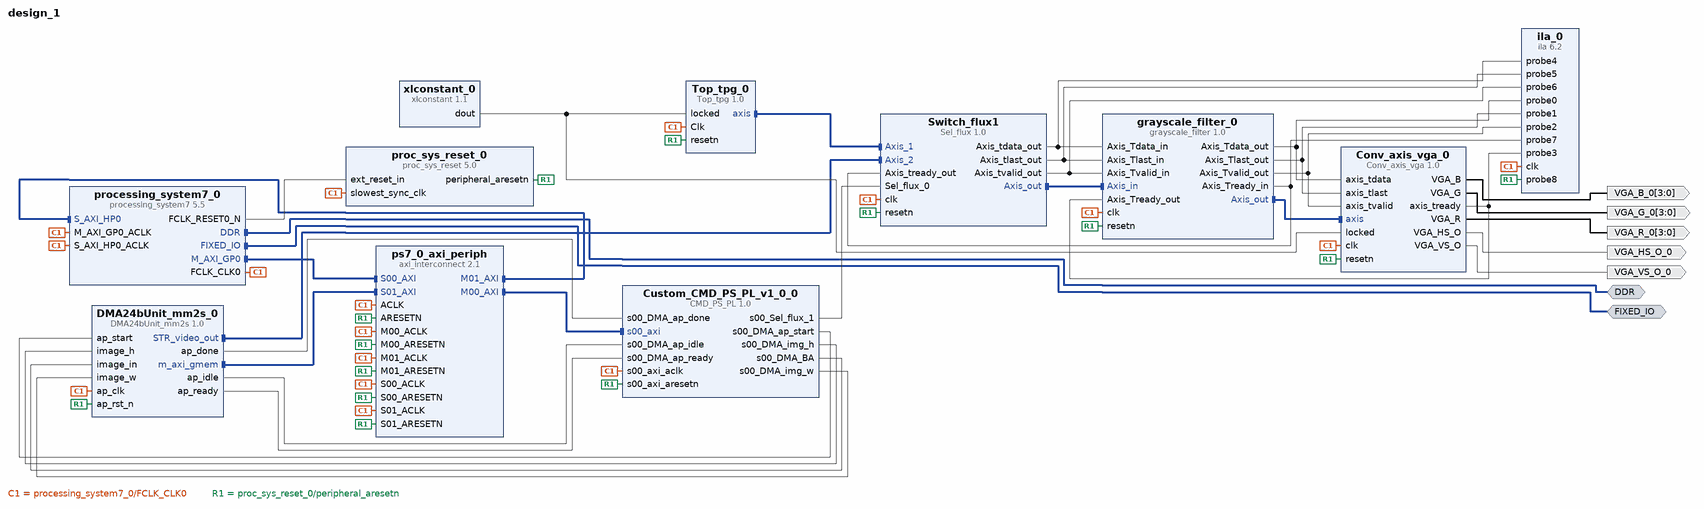
[diagram p0: block diagram of the top level]
# Vivado block design design_1, xc7z010clg400-1, Vivado 2020.2
create_bd_design design_1

create_bd_intf_port -mode Master -vlnv xilinx.com:interface:ddrx_rtl:1.0 DDR
create_bd_intf_port -mode Master -vlnv xilinx.com:display_processing_system7:fixedio_rtl:1.0 FIXED_IO
create_bd_port -dir O -from 3 -to 0 VGA_R_0
create_bd_port -dir O -from 3 -to 0 VGA_G_0
create_bd_port -dir O -from 3 -to 0 VGA_B_0
create_bd_port -dir O VGA_VS_O_0
create_bd_port -dir O VGA_HS_O_0

create_bd_cell -type ip -vlnv xilinx.com:ip:processing_system7:5.5 processing_system7_0
set_property -dict [list \
  CONFIG.PCW_APU_PERIPHERAL_FREQMHZ 650 \
  CONFIG.PCW_CRYSTAL_PERIPHERAL_FREQMHZ 50 \
  CONFIG.PCW_ENET0_PERIPHERAL_ENABLE 0 \
  CONFIG.PCW_FPGA0_PERIPHERAL_FREQMHZ 25 \
  CONFIG.PCW_FTM_CTI_IN0 DISABLED \
  CONFIG.PCW_FTM_CTI_IN1 DISABLED \
  CONFIG.PCW_FTM_CTI_IN2 DISABLED \
  CONFIG.PCW_FTM_CTI_IN3 DISABLED \
  CONFIG.PCW_FTM_CTI_OUT0 DISABLED \
  CONFIG.PCW_FTM_CTI_OUT1 DISABLED \
  CONFIG.PCW_FTM_CTI_OUT2 DISABLED \
  CONFIG.PCW_FTM_CTI_OUT3 DISABLED \
  CONFIG.PCW_GPIO_MIO_GPIO_ENABLE 1 \
  CONFIG.PCW_GPIO_MIO_GPIO_IO MIO \
  CONFIG.PCW_I2C_RESET_ENABLE 1 \
  CONFIG.PCW_PRESET_BANK1_VOLTAGE {LVCMOS 1.8V} \
  CONFIG.PCW_QSPI_PERIPHERAL_ENABLE 0 \
  CONFIG.PCW_SD0_GRP_CD_ENABLE 1 \
  CONFIG.PCW_SD0_GRP_CD_IO {MIO 47} \
  CONFIG.PCW_SD0_GRP_WP_ENABLE 0 \
  CONFIG.PCW_SD0_PERIPHERAL_ENABLE 1 \
  CONFIG.PCW_SD0_SD0_IO {MIO 40 .. 45} \
  CONFIG.PCW_SDIO_PERIPHERAL_FREQMHZ 100 \
  CONFIG.PCW_UART0_PERIPHERAL_ENABLE 1 \
  CONFIG.PCW_UART0_UART0_IO {MIO 14 .. 15} \
  CONFIG.PCW_UART_PERIPHERAL_FREQMHZ 100 \
  CONFIG.PCW_UIPARAM_DDR_BUS_WIDTH {16 Bit} \
  CONFIG.PCW_UIPARAM_DDR_FREQ_MHZ 525 \
  CONFIG.PCW_UIPARAM_DDR_PARTNO {MT41K256M16 RE-125} \
  CONFIG.PCW_USB0_PERIPHERAL_ENABLE 0 \
  CONFIG.PCW_USB_RESET_ENABLE 1 \
  CONFIG.PCW_USE_CROSS_TRIGGER 1 \
  CONFIG.PCW_USE_S_AXI_HP0 1 \
] [get_bd_cells processing_system7_0]
# 290 more settings of processing_system7_0 are not shown: defaults, MIO pin electricals, DDR timing, and values the tool derives
create_bd_cell -type ip -vlnv xilinx.com:ip:axi_interconnect:2.1 ps7_0_axi_periph
set_property -dict {CONFIG.NUM_MI 2 CONFIG.NUM_SI 2} [get_bd_cells ps7_0_axi_periph]
create_bd_cell -type ip -vlnv xilinx.com:user:CMD_PS_PL:1.0 Custom_CMD_PS_PL_v1_0_0
create_bd_cell -type ip -vlnv xilinx.com:hls:DMA24bUnit_mm2s:1.0 DMA24bUnit_mm2s_0
create_bd_cell -type ip -vlnv xilinx.com:ip:proc_sys_reset:5.0 proc_sys_reset_0
create_bd_cell -type ip -vlnv xilinx.com:ip:xlconstant:1.1 xlconstant_0
create_bd_cell -type ip -vlnv xilinx.com:user:Top_tpg:1.0 Top_tpg_0
create_bd_cell -type ip -vlnv xilinx.com:user:Conv_axis_vga:1.0 Conv_axis_vga_0
create_bd_cell -type ip -vlnv xilinx.com:user:Sel_flux:1.0 Switch_flux1
create_bd_cell -type ip -vlnv xilinx.com:ip:ila:6.2 ila_0
set_property -dict [list \
  CONFIG.C_DATA_DEPTH 1024 \
  CONFIG.C_ENABLE_ILA_AXI_MON false \
  CONFIG.C_MONITOR_TYPE Native \
  CONFIG.C_NUM_OF_PROBES 9 \
] [get_bd_cells ila_0]
create_bd_cell -type ip -vlnv xilinx.com:user:grayscale_filter:1.0 grayscale_filter_0
set_property -dict {CONFIG.C_Axis_Tdata_out_width 8} [get_bd_cells grayscale_filter_0]

# ---- connections ----

connect_bd_intf_net [get_bd_intf_pins DMA24bUnit_mm2s_0/STR_video_out] [get_bd_intf_pins Switch_flux1/Axis_2]
connect_bd_intf_net [get_bd_intf_pins Switch_flux1/Axis_out] [get_bd_intf_pins grayscale_filter_0/Axis_in]
connect_bd_intf_net [get_bd_intf_pins grayscale_filter_0/Axis_out] [get_bd_intf_pins Conv_axis_vga_0/axis]
connect_bd_intf_net [get_bd_intf_pins ps7_0_axi_periph/M01_AXI] [get_bd_intf_pins processing_system7_0/S_AXI_HP0]
connect_bd_intf_net [get_bd_intf_ports DDR] [get_bd_intf_pins processing_system7_0/DDR]
connect_bd_intf_net [get_bd_intf_ports FIXED_IO] [get_bd_intf_pins processing_system7_0/FIXED_IO]
connect_bd_intf_net [get_bd_intf_pins Top_tpg_0/axis] [get_bd_intf_pins Switch_flux1/Axis_1]
connect_bd_intf_net [get_bd_intf_pins processing_system7_0/M_AXI_GP0] [get_bd_intf_pins ps7_0_axi_periph/S00_AXI]
connect_bd_intf_net [get_bd_intf_pins ps7_0_axi_periph/S01_AXI] [get_bd_intf_pins DMA24bUnit_mm2s_0/m_axi_gmem]
connect_bd_intf_net [get_bd_intf_pins ps7_0_axi_periph/M00_AXI] [get_bd_intf_pins Custom_CMD_PS_PL_v1_0_0/s00_axi]
connect_bd_net [get_bd_pins Custom_CMD_PS_PL_v1_0_0/s00_DMA_ap_start] [get_bd_pins DMA24bUnit_mm2s_0/ap_start]
connect_bd_net [get_bd_pins Custom_CMD_PS_PL_v1_0_0/s00_DMA_img_h] [get_bd_pins DMA24bUnit_mm2s_0/image_h]
connect_bd_net [get_bd_pins Custom_CMD_PS_PL_v1_0_0/s00_DMA_BA] [get_bd_pins DMA24bUnit_mm2s_0/image_in]
connect_bd_net [get_bd_pins DMA24bUnit_mm2s_0/ap_done] [get_bd_pins Custom_CMD_PS_PL_v1_0_0/s00_DMA_ap_done]
connect_bd_net [get_bd_pins DMA24bUnit_mm2s_0/ap_idle] [get_bd_pins Custom_CMD_PS_PL_v1_0_0/s00_DMA_ap_idle]
connect_bd_net [get_bd_pins DMA24bUnit_mm2s_0/ap_ready] [get_bd_pins Custom_CMD_PS_PL_v1_0_0/s00_DMA_ap_ready]
connect_bd_net [get_bd_pins Conv_axis_vga_0/VGA_R] [get_bd_ports VGA_R_0]
connect_bd_net [get_bd_pins Conv_axis_vga_0/VGA_G] [get_bd_ports VGA_G_0]
connect_bd_net [get_bd_pins Conv_axis_vga_0/VGA_B] [get_bd_ports VGA_B_0]
connect_bd_net [get_bd_pins Conv_axis_vga_0/VGA_VS_O] [get_bd_ports VGA_VS_O_0]
connect_bd_net [get_bd_pins Conv_axis_vga_0/VGA_HS_O] [get_bd_ports VGA_HS_O_0]
connect_bd_net [get_bd_pins Custom_CMD_PS_PL_v1_0_0/s00_DMA_img_w] [get_bd_pins DMA24bUnit_mm2s_0/image_w]
connect_bd_net [get_bd_pins processing_system7_0/FCLK_CLK0] \
  [get_bd_pins Custom_CMD_PS_PL_v1_0_0/s00_axi_aclk] [get_bd_pins ps7_0_axi_periph/M00_ACLK] \
  [get_bd_pins processing_system7_0/M_AXI_GP0_ACLK] [get_bd_pins ps7_0_axi_periph/S00_ACLK] \
  [get_bd_pins processing_system7_0/S_AXI_HP0_ACLK] [get_bd_pins ps7_0_axi_periph/M01_ACLK] \
  [get_bd_pins ps7_0_axi_periph/ACLK] [get_bd_pins proc_sys_reset_0/slowest_sync_clk] [get_bd_pins DMA24bUnit_mm2s_0/ap_clk] \
  [get_bd_pins ps7_0_axi_periph/S01_ACLK] [get_bd_pins Top_tpg_0/Clk] [get_bd_pins Conv_axis_vga_0/clk] \
  [get_bd_pins Switch_flux1/clk] [get_bd_pins ila_0/clk] [get_bd_pins grayscale_filter_0/clk]
connect_bd_net [get_bd_pins processing_system7_0/FCLK_RESET0_N] [get_bd_pins proc_sys_reset_0/ext_reset_in]
connect_bd_net [get_bd_pins proc_sys_reset_0/peripheral_aresetn] \
  [get_bd_pins ps7_0_axi_periph/M01_ARESETN] [get_bd_pins ps7_0_axi_periph/S01_ARESETN] \
  [get_bd_pins ps7_0_axi_periph/M00_ARESETN] [get_bd_pins ps7_0_axi_periph/S00_ARESETN] \
  [get_bd_pins ps7_0_axi_periph/ARESETN] [get_bd_pins DMA24bUnit_mm2s_0/ap_rst_n] \
  [get_bd_pins Custom_CMD_PS_PL_v1_0_0/s00_axi_aresetn] [get_bd_pins Top_tpg_0/resetn] [get_bd_pins Conv_axis_vga_0/resetn] \
  [get_bd_pins Switch_flux1/resetn] [get_bd_pins ila_0/probe8] [get_bd_pins grayscale_filter_0/resetn]
connect_bd_net [get_bd_pins xlconstant_0/dout] [get_bd_pins Top_tpg_0/locked] [get_bd_pins Conv_axis_vga_0/locked]
connect_bd_net [get_bd_pins Custom_CMD_PS_PL_v1_0_0/s00_Sel_flux_1] [get_bd_pins Switch_flux1/Sel_flux_0]
connect_bd_net [get_bd_pins grayscale_filter_0/Axis_Tready_in] [get_bd_pins ila_0/probe7] [get_bd_pins Switch_flux1/Axis_tready_out]
connect_bd_net [get_bd_pins Switch_flux1/Axis_tdata_out] [get_bd_pins ila_0/probe4] [get_bd_pins grayscale_filter_0/Axis_Tdata_in]
connect_bd_net [get_bd_pins Switch_flux1/Axis_tlast_out] [get_bd_pins ila_0/probe5] [get_bd_pins grayscale_filter_0/Axis_Tlast_in]
connect_bd_net [get_bd_pins Switch_flux1/Axis_tvalid_out] [get_bd_pins ila_0/probe6] [get_bd_pins grayscale_filter_0/Axis_Tvalid_in]
connect_bd_net [get_bd_pins grayscale_filter_0/Axis_Tdata_out] [get_bd_pins ila_0/probe0] [get_bd_pins Conv_axis_vga_0/axis_tdata]
connect_bd_net [get_bd_pins grayscale_filter_0/Axis_Tlast_out] [get_bd_pins ila_0/probe1] [get_bd_pins Conv_axis_vga_0/axis_tlast]
connect_bd_net [get_bd_pins grayscale_filter_0/Axis_Tvalid_out] [get_bd_pins ila_0/probe2] [get_bd_pins Conv_axis_vga_0/axis_tvalid]
connect_bd_net [get_bd_pins Conv_axis_vga_0/axis_tready] [get_bd_pins ila_0/probe3] [get_bd_pins grayscale_filter_0/Axis_Tready_out]

# ---- address map ----
assign_bd_address -offset 0x0000000000000000 -range 512M -target_address_space [get_bd_addr_spaces DMA24bUnit_mm2s_0/Data_m_axi_gmem] [get_bd_addr_segs processing_system7_0/S_AXI_HP0/HP0_DDR_LOWOCM]
exclude_bd_addr_seg -offset 0x0000000043C00000 -range 64K -target_address_space [get_bd_addr_spaces DMA24bUnit_mm2s_0/Data_m_axi_gmem] [get_bd_addr_segs Custom_CMD_PS_PL_v1_0_0/s00_axi/reg0]
assign_bd_address -offset 0x43C00000 -range 64K -target_address_space [get_bd_addr_spaces processing_system7_0/Data] [get_bd_addr_segs Custom_CMD_PS_PL_v1_0_0/s00_axi/reg0]
exclude_bd_addr_seg -offset 0x00000000 -range 1 -target_address_space [get_bd_addr_spaces processing_system7_0/Data] [get_bd_addr_segs processing_system7_0/S_AXI_HP0/HP0_DDR_LOWOCM]

validate_bd_design
save_bd_design
